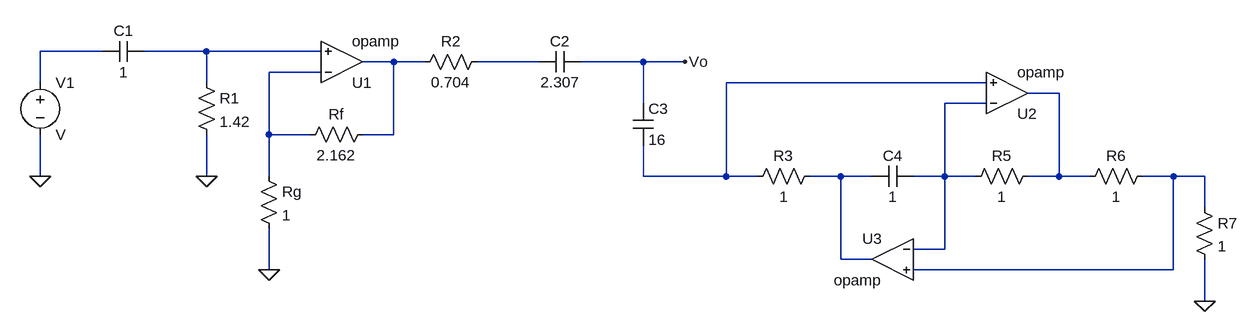
[diagram p0: schematic circuito_sin_inductores.asc]
circuito_sin_inductores.asc, the LTspice schematic file:
Version 4.1
SHEET 1 880 680
WIRE -1008 -64 -1104 -64
WIRE -848 -64 -944 -64
WIRE -672 -64 -848 -64
WIRE -560 -48 -608 -48
WIRE -512 -48 -560 -48
WIRE -336 -48 -432 -48
WIRE -176 -48 -272 -48
WIRE -112 -48 -176 -48
WIRE -672 -32 -752 -32
WIRE -1104 -16 -1104 -64
WIRE -848 -16 -848 -64
WIRE 352 -16 -48 -16
WIRE 464 0 416 0
WIRE -176 16 -176 -48
WIRE 352 16 288 16
WIRE -752 64 -752 -32
WIRE -688 64 -752 64
WIRE -560 64 -560 -48
WIRE -560 64 -608 64
WIRE -1104 128 -1104 64
WIRE -848 128 -848 64
WIRE -752 128 -752 64
WIRE -176 128 -176 80
WIRE -48 128 -48 -16
WIRE -48 128 -176 128
WIRE 0 128 -48 128
WIRE 128 128 80 128
WIRE 176 128 128 128
WIRE 288 128 288 16
WIRE 288 128 240 128
WIRE 336 128 288 128
WIRE 464 128 464 0
WIRE 464 128 416 128
WIRE 512 128 464 128
WIRE 640 128 592 128
WIRE 688 128 640 128
WIRE 688 176 688 128
WIRE 288 240 288 128
WIRE 288 240 240 240
WIRE 128 256 128 128
WIRE 176 256 128 256
WIRE -752 272 -752 208
WIRE 640 272 640 128
WIRE 640 272 240 272
WIRE 688 320 688 256
FLAG 688 320 0
FLAG -848 128 0
FLAG -1104 128 0
FLAG -112 -48 Vo
FLAG -752 272 0
SYMBOL res 96 112 R90
WINDOW 0 0 56 VBottom 2
WINDOW 3 32 56 VTop 2
SYMATTR InstName R3
SYMATTR Value 1
SYMBOL cap 240 112 R90
WINDOW 0 0 32 VBottom 2
WINDOW 3 32 32 VTop 2
SYMATTR InstName C4
SYMATTR Value 1
SYMBOL res 672 160 R0
SYMATTR InstName R7
SYMATTR Value 1
SYMBOL res 432 112 R90
WINDOW 0 0 56 VBottom 2
WINDOW 3 32 56 VTop 2
SYMATTR InstName R5
SYMATTR Value 1
SYMBOL res 608 112 R90
WINDOW 0 0 56 VBottom 2
WINDOW 3 32 56 VTop 2
SYMATTR InstName R6
SYMATTR Value 1
SYMBOL OpAmps\\opamp 384 64 M180
SYMATTR InstName U2
SYMBOL OpAmps\\opamp 208 192 M0
SYMATTR InstName U3
SYMBOL res -864 -32 R0
SYMATTR InstName R1
SYMATTR Value 1.42
SYMBOL cap -944 -80 R90
WINDOW 0 0 32 VBottom 2
WINDOW 3 32 32 VTop 2
SYMATTR InstName C1
SYMATTR Value 1
SYMBOL OpAmps\\opamp -640 16 M180
SYMATTR InstName U1
SYMBOL res -416 -64 R90
WINDOW 0 0 56 VBottom 2
WINDOW 3 32 56 VTop 2
SYMATTR InstName R2
SYMATTR Value 0.704
SYMBOL cap -272 -64 R90
WINDOW 0 0 32 VBottom 2
WINDOW 3 32 32 VTop 2
SYMATTR InstName C2
SYMATTR Value 2.307
SYMBOL cap -192 16 R0
SYMATTR InstName C3
SYMATTR Value 16
SYMBOL voltage -1104 -32 R0
SYMATTR InstName V1
SYMBOL res -592 48 R90
WINDOW 0 0 56 VBottom 2
WINDOW 3 32 56 VTop 2
SYMATTR InstName Rf
SYMATTR Value 2.162
SYMBOL res -768 112 R0
SYMATTR InstName Rg
SYMATTR Value 1

The netlist it stands for:
* circuito_sin_inductores.asc
R3 N009 N006 1
C4 N008 N009 1
R7 N010 0 1
R5 N007 N008 1
R6 N010 N007 1
X§U2 N008 N006 N007 opamp Aol=100K GBW=10Meg  ; pins invin noninvin out
X§U3 N008 N010 N009 opamp Aol=100K GBW=10Meg  ; pins invin noninvin out
R1 N002 0 1.42
C1 N002 N001 1
X§U1 N005 N002 N003 opamp Aol=100K GBW=10Meg  ; pins invin noninvin out
R2 N004 N003 0.704
C2 Vo N004 2.307
C3 Vo N006 16
V1 N001 0 V
Rf N003 N005 2.162
Rg N005 0 1
.backanno
.end